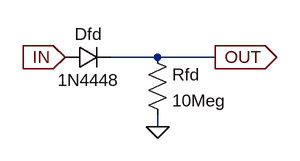
[diagram p0: schematic fd.asc]
fd.asc, the LTspice schematic file:
Version 4
SHEET 1 880 680
WIRE 160 144 96 144
WIRE 240 144 160 144
WIRE 160 240 160 224
FLAG 160 240 0
FLAG 32 144 IN
IOPIN 32 144 In
FLAG 240 144 OUT
IOPIN 240 144 Out
SYMBOL diode 32 160 R270
WINDOW 0 32 32 VTop 0
WINDOW 3 0 32 VBottom 0
SYMATTR InstName Dfd
SYMATTR Value 1N4448
SYMBOL res 144 128 R0
SYMATTR InstName Rfd
SYMATTR Value 10Meg

The netlist it stands for:
* fd.asc
Dfd IN OUT 1N4448
Rfd OUT 0 10Meg
.model D D
.lib standard.dio
.backanno
.end